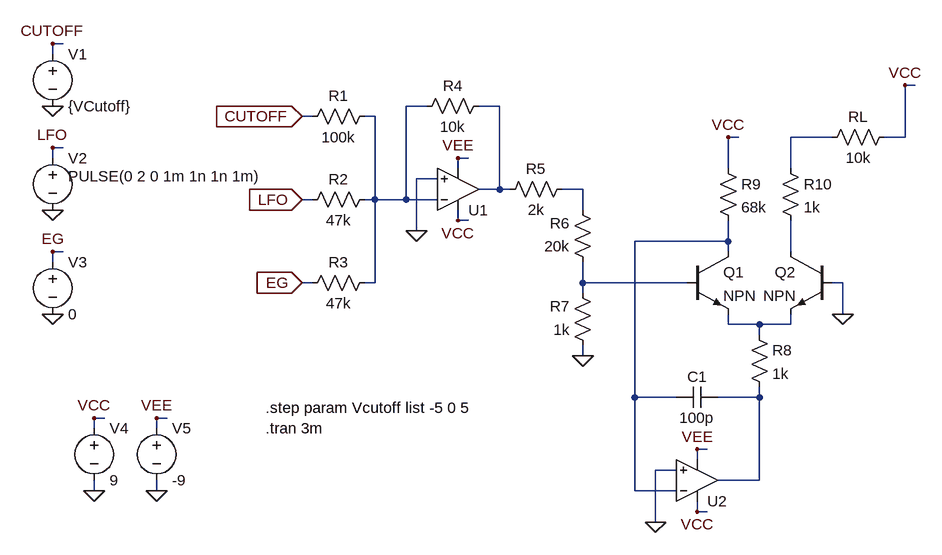
[diagram p0: schematic Antilog_NPNO.asc]
Antilog_NPNO.asc, the LTspice schematic file:
Version 4
SHEET 1 1148 780
WIRE -288 0 -304 0
WIRE -304 16 -304 0
WIRE 1024 64 1008 64
WIRE 272 96 240 96
WIRE 384 96 352 96
WIRE 96 112 80 112
WIRE 192 112 176 112
WIRE 752 144 736 144
WIRE 896 144 832 144
WIRE 1008 144 1008 64
WIRE 1008 144 976 144
WIRE -288 160 -304 160
WIRE -304 176 -304 160
WIRE 336 176 320 176
WIRE 320 192 320 176
WIRE 736 192 736 144
WIRE 832 192 832 144
WIRE 288 208 256 208
WIRE 384 224 384 96
WIRE 384 224 352 224
WIRE 400 224 384 224
WIRE 512 224 480 224
WIRE 96 240 80 240
WIRE 192 240 192 112
WIRE 192 240 176 240
WIRE 240 240 240 96
WIRE 240 240 192 240
WIRE 288 240 240 240
WIRE 512 256 512 224
WIRE 320 272 320 256
WIRE 336 272 320 272
WIRE 256 288 256 208
WIRE 736 304 736 272
WIRE 736 304 592 304
WIRE -288 320 -304 320
WIRE 736 320 736 304
WIRE 832 320 832 272
WIRE -304 336 -304 320
WIRE 96 368 80 368
WIRE 192 368 192 240
WIRE 192 368 176 368
WIRE 512 368 512 336
WIRE 672 368 512 368
WIRE 912 368 896 368
WIRE 512 384 512 368
WIRE 912 416 912 368
WIRE 736 432 736 416
WIRE 784 432 736 432
WIRE 832 432 832 416
WIRE 832 432 784 432
WIRE 784 448 784 432
WIRE 512 480 512 464
WIRE 592 544 592 304
WIRE 656 544 592 544
WIRE 784 544 784 528
WIRE 784 544 720 544
WIRE -224 576 -240 576
WIRE -128 576 -144 576
WIRE -240 592 -240 576
WIRE -144 592 -144 576
WIRE 704 624 688 624
WIRE 688 640 688 624
WIRE 656 656 624 656
WIRE 784 672 784 544
WIRE 784 672 720 672
WIRE -240 688 -240 672
WIRE -144 688 -144 672
WIRE 592 688 592 544
WIRE 656 688 592 688
WIRE 688 720 688 704
WIRE 704 720 688 720
WIRE 624 736 624 656
FLAG 320 176 VEE
FLAG 320 272 VCC
FLAG 256 288 0
FLAG -304 0 CUTOFF
FLAG -304 160 LFO
FLAG -304 320 EG
FLAG -304 96 0
FLAG -304 256 0
FLAG -304 416 0
FLAG 80 112 CUTOFF
IOPIN 80 112 In
FLAG 80 240 LFO
IOPIN 80 240 In
FLAG 80 368 EG
IOPIN 80 368 In
FLAG 512 480 0
FLAG 688 624 VEE
FLAG 688 720 VCC
FLAG 624 736 0
FLAG 1008 64 VCC
FLAG 912 416 0
FLAG 736 144 VCC
FLAG -240 688 0
FLAG -144 688 0
FLAG -240 576 VCC
FLAG -144 576 VEE
SYMBOL res 192 96 R90
WINDOW 0 0 56 VBottom 2
WINDOW 3 32 56 VTop 2
SYMATTR InstName R1
SYMATTR Value 100k
SYMBOL res 192 224 R90
WINDOW 0 0 56 VBottom 2
WINDOW 3 32 56 VTop 2
SYMATTR InstName R2
SYMATTR Value 47k
SYMBOL res 192 352 R90
WINDOW 0 0 56 VBottom 2
WINDOW 3 32 56 VTop 2
SYMATTR InstName R3
SYMATTR Value 47k
SYMBOL Opamps\\UniversalOpamp2 320 224 M180
SYMATTR InstName U1
SYMBOL res 368 80 R90
WINDOW 0 0 56 VBottom 2
WINDOW 3 32 56 VTop 2
SYMATTR InstName R4
SYMATTR Value 10k
SYMBOL voltage -304 0 R0
WINDOW 123 0 0 Left 2
WINDOW 39 0 0 Left 2
SYMATTR InstName V1
SYMATTR Value {VCutoff}
SYMBOL voltage -304 160 R0
WINDOW 123 0 0 Left 2
WINDOW 39 0 0 Left 2
WINDOW 3 24 44 Left 2
SYMATTR Value PULSE(0 2 0 1m 1n 1n 1m)
SYMATTR InstName V2
SYMBOL voltage -304 320 R0
WINDOW 123 0 0 Left 2
WINDOW 39 0 0 Left 2
SYMATTR InstName V3
SYMATTR Value 0
SYMBOL res 496 208 R90
WINDOW 0 0 56 VBottom 2
WINDOW 3 32 56 VTop 2
SYMATTR InstName R5
SYMATTR Value 2k
SYMBOL res 528 352 R180
WINDOW 0 36 76 Left 2
WINDOW 3 36 40 Left 2
SYMATTR InstName R6
SYMATTR Value 20k
SYMBOL res 528 480 R180
WINDOW 0 36 76 Left 2
WINDOW 3 36 40 Left 2
SYMATTR InstName R7
SYMATTR Value 1k
SYMBOL npn 672 320 R0
SYMATTR InstName Q1
SYMBOL npn 896 320 M0
SYMATTR InstName Q2
SYMBOL res 768 432 R0
SYMATTR InstName R8
SYMATTR Value 1k
SYMBOL Opamps\\UniversalOpamp2 688 672 M180
SYMATTR InstName U2
SYMBOL cap 720 528 R90
WINDOW 0 0 32 VBottom 2
WINDOW 3 32 32 VTop 2
SYMATTR InstName C1
SYMATTR Value 100p
SYMBOL res 720 176 R0
SYMATTR InstName R9
SYMATTR Value 68k
SYMBOL res 816 176 R0
SYMATTR InstName R10
SYMATTR Value 1k
SYMBOL res 992 128 R90
WINDOW 0 0 56 VBottom 2
WINDOW 3 32 56 VTop 2
SYMATTR InstName RL
SYMATTR Value 10k
SYMBOL voltage -240 576 R0
WINDOW 123 0 0 Left 2
WINDOW 39 0 0 Left 2
SYMATTR InstName V4
SYMATTR Value 9
SYMBOL voltage -144 576 R0
WINDOW 123 0 0 Left 2
WINDOW 39 0 0 Left 2
SYMATTR InstName V5
SYMATTR Value -9
TEXT 24 560 Left 2 !.step param Vcutoff list -5 0 5
TEXT 24 592 Left 2 !.tran 3m

The netlist it stands for:
* Antilog_NPNO.asc
R1 N001 CUTOFF 100k
R2 N001 LFO 47k
R3 N001 EG 47k
XU1 0 N001 VCC VEE N002 level.2 Avol=1Meg GBW=10Meg Slew=10Meg ilimit=25m rail=0 Vos=0 phimargin=45 en=0 enk=0 in=0 ink=0 Rin=500Meg  ; pins IN+ IN- V+ V- OUT
R4 N002 N001 10k
V1 CUTOFF 0 {VCutoff}
V2 LFO 0 PULSE(0 2 0 1m 1n 1n 1m)
V3 EG 0 0
R5 N004 N002 2k
R6 N007 N004 20k
R7 0 N007 1k
Q1 N005 N007 N008 0 NPN
Q2 N006 0 N008 0 NPN
R8 N008 N009 1k
XU2 0 N005 VCC VEE N009 level.2 Avol=1Meg GBW=10Meg Slew=10Meg ilimit=25m rail=0 Vos=0 phimargin=45 en=0 enk=0 in=0 ink=0 Rin=500Meg  ; pins IN+ IN- V+ V- OUT
C1 N009 N005 100p
R9 VCC N005 68k
R10 N003 N006 1k
RL VCC N003 10k
V4 VCC 0 9
V5 VEE 0 -9
.model NPN NPN
.model PNP PNP
.lib standard.bjt
.step param Vcutoff list -5 0 5
.tran 3m
.lib UniversalOpamps2.sub
.backanno
.end